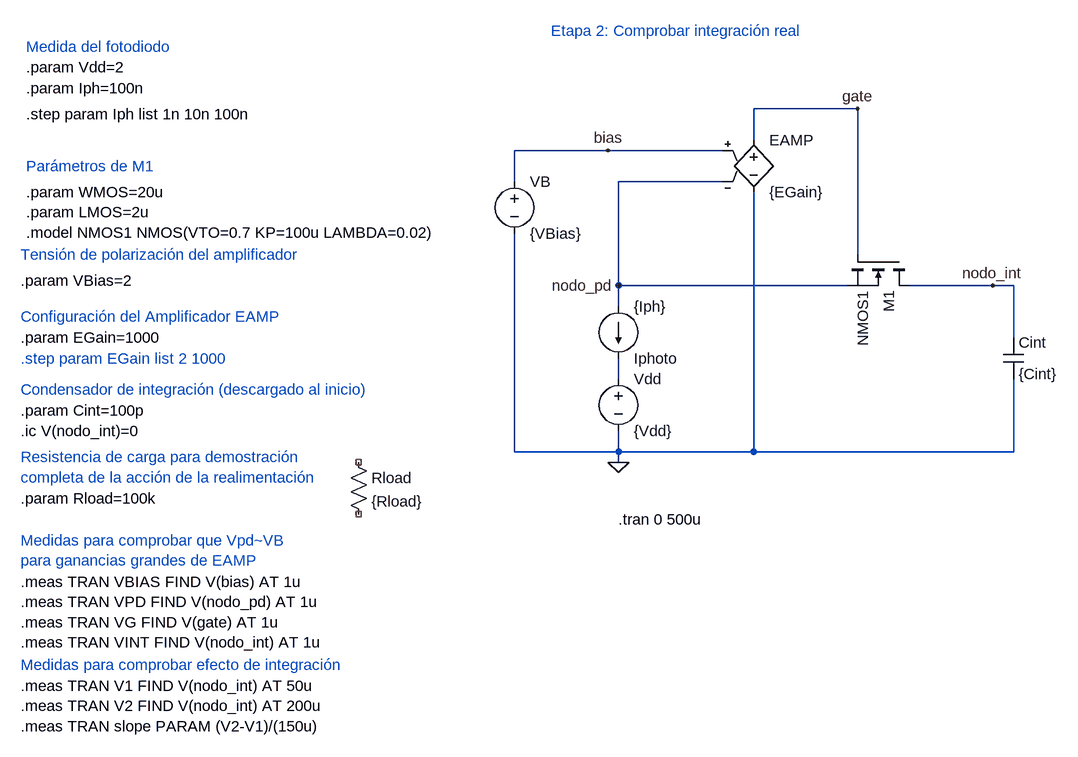
[diagram p0: schematic BDI_Etapa2.asc]
BDI_Etapa2.asc, the LTspice schematic file:
Version 4.1
SHEET 1 948 1096
WIRE 304 112 144 112
WIRE 144 160 144 112
WIRE -80 176 -224 176
WIRE 96 176 -80 176
WIRE -224 224 -224 176
WIRE 96 224 -64 224
WIRE 304 336 304 112
WIRE -64 384 -64 224
WIRE 288 384 -64 384
WIRE 512 384 384 384
WIRE 544 384 512 384
WIRE -64 416 -64 384
WIRE 544 464 544 384
WIRE -64 528 -64 496
WIRE -224 640 -224 304
WIRE -64 640 -64 608
WIRE -64 640 -224 640
WIRE 144 640 144 240
WIRE 144 640 -64 640
WIRE 544 640 544 528
WIRE 544 640 144 640
WIRE -64 656 -64 640
FLAG -64 656 0
FLAG -64 384 nodo_pd
FLAG 304 112 gate
FLAG -80 176 bias
FLAG 512 384 nodo_int
DATAFLAG -160 176 ""
DATAFLAG -16 224 ""
DATAFLAG 144 112 ""
SYMBOL e 144 144 R0
SYMATTR InstName EAMP
SYMATTR Value {EGain}
SYMBOL voltage -224 208 R0
SYMATTR InstName VB
SYMATTR Value {VBias}
SYMBOL current -64 416 R0
WINDOW 0 24 80 Left 2
WINDOW 3 24 0 Left 2
WINDOW 123 0 0 Left 0
WINDOW 39 0 0 Left 0
SYMATTR InstName Iphoto
SYMATTR Value {Iph}
SYMBOL nmos 384 336 R90
SYMATTR InstName M1
SYMATTR Value NMOS1
SYMATTR SpiceLine L={LMOS} W={WMOS}
SYMBOL voltage -64 512 R0
SYMATTR InstName Vdd
SYMATTR Value {Vdd}
SYMBOL cap 528 464 R0
SYMATTR InstName Cint
SYMATTR Value {Cint}
SYMBOL res -480 640 R0
SYMATTR InstName Rload
SYMATTR Value {Rload}
TEXT -168 -8 Left 2 ;Etapa 2: Comprobar integración real
TEXT -976 80 Left 2 !.param Iph=100n
TEXT -976 16 Left 2 ;Medida del fotodiodo
TEXT -976 120 Left 2 !.step param Iph list 1n 10n 100n
TEXT -976 240 Left 2 !.param WMOS=20u\n.param LMOS=2u\n.model NMOS1 NMOS(VTO=0.7 KP=100u LAMBDA=0.02)
TEXT -976 200 Left 2 ;Parámetros de M1
TEXT -984 376 Left 2 !.param VBias=2
TEXT -984 336 Left 2 ;Tensión de polarización del amplificador
TEXT -984 776 Left 2 ;Medidas para comprobar que Vpd~VB \npara ganancias grandes de EAMP
TEXT -64 744 Left 2 !.tran 0 500u
TEXT -984 840 Left 2 !.meas TRAN VBIAS FIND V(bias) AT 1u\n.meas TRAN VPD FIND V(nodo_pd) AT 1u\n.meas TRAN VG FIND V(gate) AT 1u\n.meas TRAN VINT FIND V(nodo_int) AT 1u
TEXT -976 48 Left 2 !.param Vdd=2
TEXT -984 464 Left 2 !.param EGain=1000
TEXT -984 496 Left 2 ;.step param EGain list 2 1000
TEXT -984 432 Left 2 ;Configuración del Amplificador EAMP
TEXT -984 608 Left 2 !.ic V(nodo_int)=0
TEXT -984 544 Left 2 ;Condensador de integración (descargado al inicio)
TEXT -984 576 Left 2 !.param Cint=100p
TEXT -984 1000 Left 2 !.meas TRAN V1 FIND V(nodo_int) AT 50u\n.meas TRAN V2 FIND V(nodo_int) AT 200u\n.meas TRAN slope PARAM (V2-V1)/(150u)
TEXT -984 968 Left 2 ;Medidas para comprobar efecto de integración
TEXT -984 648 Left 2 ;Resistencia de carga para demostración \ncompleta de la acción de la realimentación
TEXT -984 712 Left 2 !.param Rload=100k

The netlist it stands for:
* BDI_Etapa2.asc
EAMP gate 0 bias nodo_pd {EGain}
VB bias 0 {VBias}
Iphoto nodo_pd N001 {Iph}
M1 nodo_int gate nodo_pd nodo_pd NMOS1 L={LMOS} W={WMOS}
Vdd N001 0 {Vdd}
Cint nodo_int 0 {Cint}
Rload NC_01 NC_02 {Rload}
.model NMOS NMOS
.model PMOS PMOS
.lib standard.mos
* Etapa 2: Comprobar integración real
.param Iph=100n
* Medida del fotodiodo
.step param Iph list 1n 10n 100n
.param WMOS=20u
.param LMOS=2u
.model NMOS1 NMOS(VTO=0.7 KP=100u LAMBDA=0.02)
* Parámetros de M1
.param VBias=2
* Tensión de polarización del amplificador
* Medidas para comprobar que Vpd~VB
* para ganancias grandes de EAMP
.tran 0 500u
.meas TRAN VBIAS FIND V(bias) AT 1u
.meas TRAN VPD FIND V(nodo_pd) AT 1u
.meas TRAN VG FIND V(gate) AT 1u
.meas TRAN VINT FIND V(nodo_int) AT 1u
.param Vdd=2
.param EGain=1000
* .step param EGain list 2 1000
* Configuración del Amplificador EAMP
.ic V(nodo_int)=0
* Condensador de integración (descargado al inicio)
.param Cint=100p
.meas TRAN V1 FIND V(nodo_int) AT 50u
.meas TRAN V2 FIND V(nodo_int) AT 200u
.meas TRAN slope PARAM (V2-V1)/(150u)
* Medidas para comprobar efecto de integración
* Resistencia de carga para demostración
* completa de la acción de la realimentación
.param Rload=100k
.backanno
.end